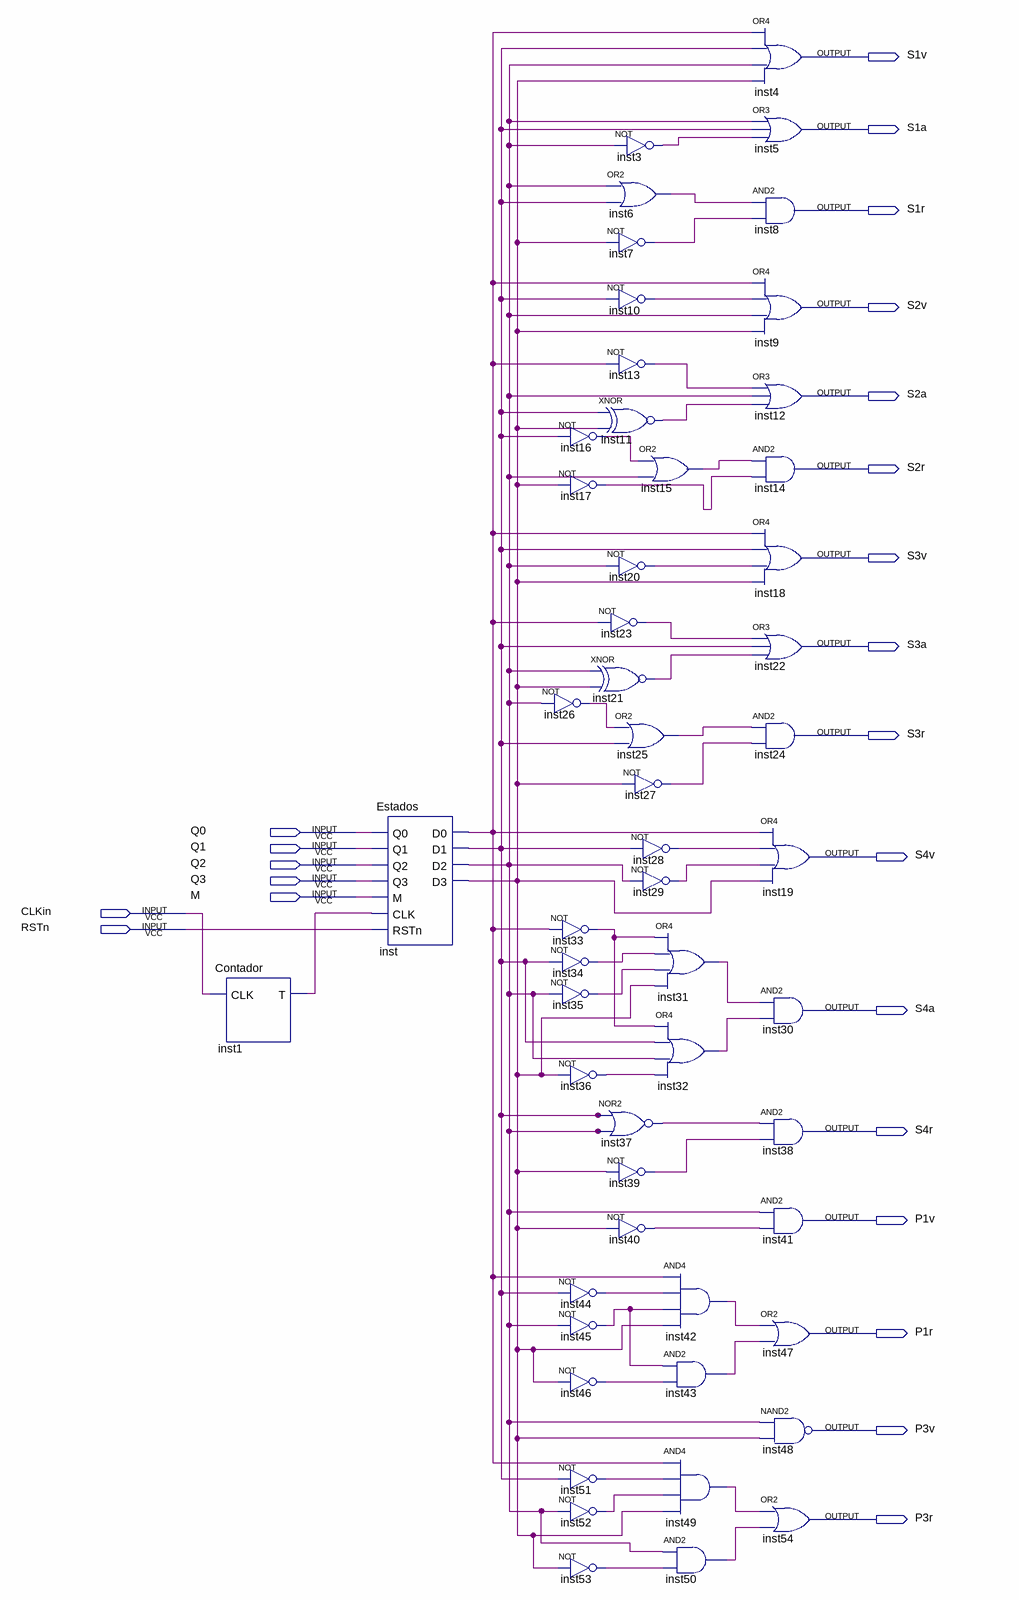
[diagram p0: schematic sheet]
// Quartus schematic MAIN_Semaforos.bdf as structural Verilog: 54 symbols, 23 pins
module MAIN_Semaforos (
  input  Q0,
  input  Q1,
  input  Q2,
  input  Q3,
  input  M,
  input  CLKin,
  input  RSTn,
  output S1v,
  output S1a,
  output S1r,
  output S2v,
  output S2a,
  output S2r,
  output S3v,
  output S3a,
  output S3r,
  output S4v,
  output S4a,
  output S4r,
  output P1v,
  output P1r,
  output P3v,
  output P3r
);

  wire inst1_t, inst3_out, inst6_out, inst7_out, inst10_out, inst11_out, inst13_out, inst15_out, inst16_out,
       inst17_out, inst20_out, inst21_out, inst23_out, inst25_out, inst26_out, inst27_out, inst28_out,
       inst29_out, inst31_out, inst32_out, inst33_out, inst34_out, inst35_out, inst36_out, inst37_out,
       inst39_out, inst40_out, inst42_out, inst43_out, inst44_out, inst45_out, inst46_out, inst49_out,
       inst50_out, inst51_out, inst52_out, inst53_out, inst_d0, inst_d1, inst_d2, inst_d3;

  Contador inst1 (.CLK(CLKin), .T(inst1_t));
  Estados inst (
    .Q0(Q0), .Q1(Q1), .Q2(Q2), .Q3(Q3), .M(M), .CLK(inst1_t), .RSTn(RSTn), .D0(inst_d0), .D1(inst_d1),
    .D2(inst_d2), .D3(inst_d3));
  not inst16 (inst16_out, inst_d1);
  not inst17 (inst17_out, inst_d3);
  not inst26 (inst26_out, inst_d2);
  not inst33 (inst33_out, inst_d0);
  not inst34 (inst34_out, inst_d1);
  not inst35 (inst35_out, inst_d2);
  not inst36 (inst36_out, inst_d3);
  not inst44 (inst44_out, inst_d1);
  not inst45 (inst45_out, inst_d2);
  not inst46 (inst46_out, inst_d3);
  not inst51 (inst51_out, inst_d1);
  not inst52 (inst52_out, inst_d2);
  not inst53 (inst53_out, inst_d3);
  not inst3 (inst3_out, inst_d2);
  or inst6 (inst6_out, inst_d2, inst_d1);
  not inst7 (inst7_out, inst_d3);
  not inst10 (inst10_out, inst_d1);
  not inst13 (inst13_out, inst_d0);
  xnor inst11 (inst11_out, inst_d1, inst_d3);
  not inst20 (inst20_out, inst_d2);
  not inst23 (inst23_out, inst_d0);
  xnor inst21 (inst21_out, inst_d2, inst_d3);
  or inst25 (inst25_out, inst26_out, inst_d1);
  not inst27 (inst27_out, inst_d3);
  not inst28 (inst28_out, inst_d1);
  not inst29 (inst29_out, inst_d2);
  nor inst37 (inst37_out, inst_d1, inst_d2);
  not inst39 (inst39_out, inst_d3);
  not inst40 (inst40_out, inst_d3);
  or inst15 (inst15_out, inst16_out, inst_d2);
  or inst31 (inst31_out, inst33_out, inst34_out, inst35_out, inst_d3);
  or inst32 (inst32_out, inst33_out, inst_d1, inst_d2, inst36_out);
  and inst42 (inst42_out, inst_d0, inst44_out, inst45_out, inst_d3);
  and inst43 (inst43_out, inst45_out, inst46_out);
  and inst49 (inst49_out, inst_d0, inst51_out, inst52_out, inst_d3);
  and inst50 (inst50_out, inst_d2, inst53_out);
  or inst4 (S1v, inst_d0, inst_d1, inst_d2, inst_d3);
  or inst5 (S1a, inst_d2, inst_d1, inst3_out);
  and inst8 (S1r, inst6_out, inst7_out);
  or inst9 (S2v, inst_d0, inst10_out, inst_d2, inst_d3);
  or inst12 (S2a, inst13_out, inst_d2, inst11_out);
  and inst14 (S2r, inst15_out, inst17_out);
  or inst18 (S3v, inst_d0, inst_d1, inst20_out, inst_d3);
  or inst22 (S3a, inst23_out, inst_d1, inst21_out);
  and inst24 (S3r, inst25_out, inst27_out);
  or inst19 (S4v, inst_d0, inst28_out, inst29_out, inst_d3);
  and inst30 (S4a, inst31_out, inst32_out);
  and inst38 (S4r, inst37_out, inst39_out);
  and inst41 (P1v, inst_d2, inst40_out);
  or inst47 (P1r, inst42_out, inst43_out);
  nand inst48 (P3v, inst_d2, inst_d3);
  or inst54 (P3r, inst49_out, inst50_out);
endmodule
